# Altium schematic sheet S00-OVERVIEW.SchDoc
size B; SheetNumber: 1; SheetTotal: 3; BLOCK-TITLE: OVERVIEW AND TITLE PAGE; BLOCK-SIZE: B; BLOCK-PROJECT: MULTIMOD SERVO MODULE; BLOCK-REVISION: 1; BLOCK-ORGANIZATION: UNIVERSITY OF FLORIDA; BLOCK-DESIGNER: MEHRON TALEBI; BLOCK-IDENTIFIER: SUMMER 2023; BLOCK-REVIEWER: MIKE STAPLETON
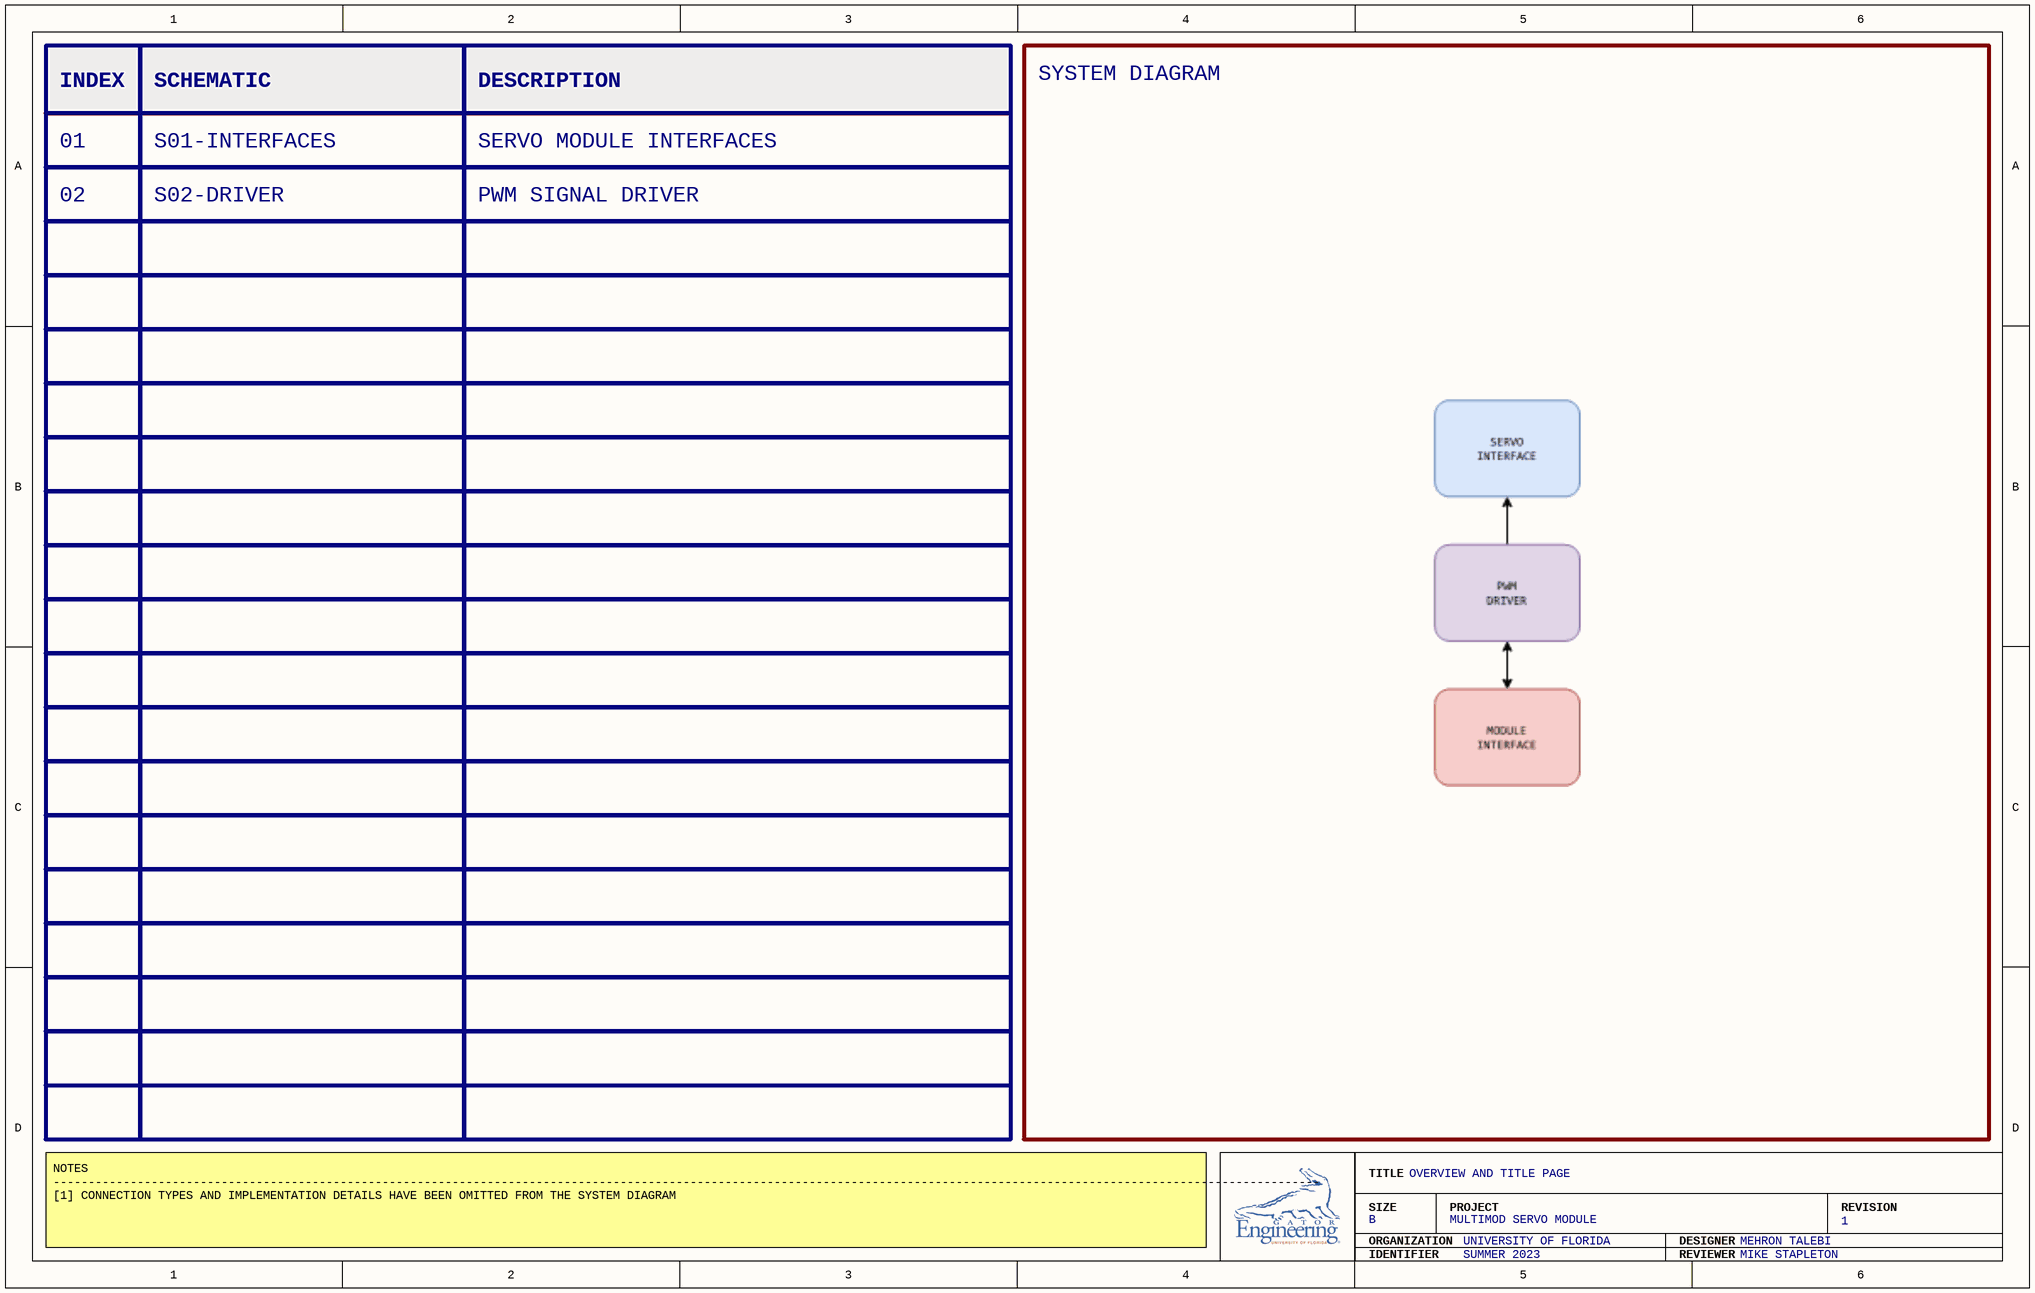
[diagram p0: S00-OVERVIEW.SchDoc]

## Notes on the sheet
- INDEX
- SCHEMATIC
- DESCRIPTION
- SYSTEM DIAGRAM
- 01
- S01-INTERFACES
- SERVO MODULE INTERFACES
- 02
- S02-DRIVER
- PWM SIGNAL DRIVER
- NOTES
  -------------------------------------------------------------------------------------------------------------------------------------------------------------------------------------
  [1] CONNECTION TYPES AND IMPLEMENTATION DETAILS HAVE BEEN OMITTED FROM THE SYSTEM DIAGRAM
- TITLE
- SIZE
- ORGANIZATION
- PROJECT
- DESIGNER
- REVISION
- IDENTIFIER
- REVIEWER